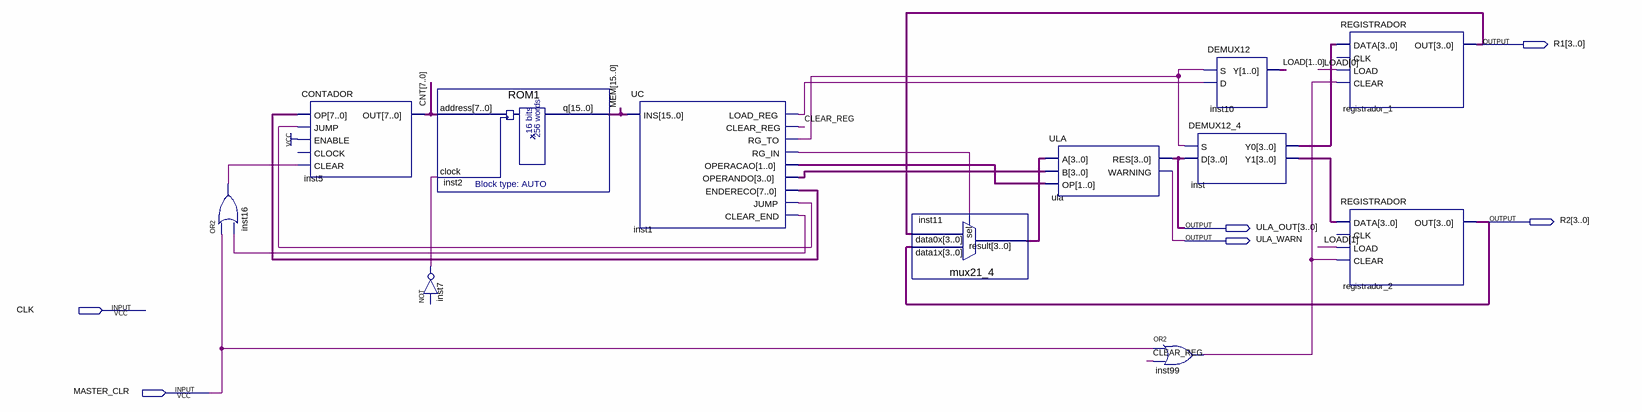
[diagram p0: schematic sheet]
// Quartus schematic TESTE_PRINCIPAL.bdf as structural Verilog: 12 symbols, 6 pins
module TESTE_PRINCIPAL (
  input  CLK,
  input  MASTER_CLR,
  output [3:0] R1,
  output [3:0] R2,
  output [3:0] ULA_OUT,
  output ULA_WARN
);

  wire CLEAR_REG, inst1_clear_end, inst1_jump, inst1_load_reg, inst1_rg_in, inst1_rg_to, inst7_out,
       inst16_out, inst99_out;
  wire [1:0] inst1_operacao, LOAD;
  wire [3:0] inst1_operando, inst11_result, inst_y0, inst_y1;
  wire [7:0] CNT, inst1_endereco;
  wire [15:0] MEM;

  or inst16 (inst16_out, MASTER_CLR, inst1_clear_end);
  CONTADOR inst5 (.OP(inst1_endereco), .JUMP(inst1_jump), .ENABLE(1'b1), .CLEAR(inst16_out), .OUT(CNT));  // open: CLOCK
  ROM1 inst2 (.address(CNT), .clock(inst7_out), .q(MEM));
  // NOT inst7 has open pins: IN=open, OUT=inst7_out
  UC inst1 (
    .INS(MEM), .LOAD_REG(inst1_load_reg), .CLEAR_REG(CLEAR_REG), .RG_TO(inst1_rg_to), .RG_IN(inst1_rg_in),
    .OPERACAO(inst1_operacao), .OPERANDO(inst1_operando), .ENDERECO(inst1_endereco), .JUMP(inst1_jump),
    .CLEAR_END(inst1_clear_end));
  mux21_4 inst11 (.data1x(R2), .data0x(R1), .sel(inst1_rg_in), .result(inst11_result));
  ULA ula (.A(inst11_result), .B(inst1_operando), .OP(inst1_operacao), .RES(ULA_OUT), .WARNING(ULA_WARN));
  or inst99 (inst99_out, MASTER_CLR, CLEAR_REG);
  DEMUX12 inst10 (.S(inst1_rg_to), .D(inst1_load_reg), .Y(LOAD));
  DEMUX12_4 inst (.S(inst1_rg_to), .D(ULA_OUT), .Y0(inst_y0), .Y1(inst_y1));
  REGISTRADOR registrador_1 (.DATA(inst_y0), .LOAD(LOAD[0]), .CLEAR(inst99_out), .OUT(R1));  // open: CLK
  REGISTRADOR registrador_2 (.DATA(inst_y1), .LOAD(LOAD[1]), .CLEAR(inst99_out), .OUT(R2));  // open: CLK
endmodule
